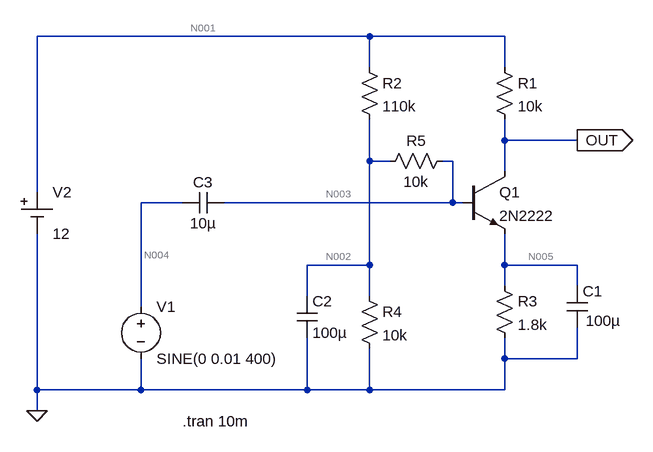
[diagram p0: schematic Common emitter.asc]
Common emitter.asc, the LTspice schematic file:
Version 4
SHEET 1 880 680
WIRE -144 -80 -656 -80
WIRE 64 -80 -144 -80
WIRE -144 -32 -144 -80
WIRE 64 -32 64 -80
WIRE 64 80 64 48
WIRE 176 80 64 80
WIRE -144 112 -144 48
WIRE -112 112 -144 112
WIRE -16 112 -32 112
WIRE 64 128 64 80
WIRE -656 160 -656 -80
WIRE -432 176 -496 176
WIRE -16 176 -16 112
WIRE -16 176 -368 176
WIRE 0 176 -16 176
WIRE -144 272 -144 112
WIRE -144 272 -240 272
WIRE 64 272 64 224
WIRE 176 272 64 272
WIRE 64 304 64 272
WIRE 176 304 176 272
WIRE -240 320 -240 272
WIRE -144 320 -144 272
WIRE -496 336 -496 176
WIRE 64 416 64 384
WIRE 176 416 176 368
WIRE 176 416 64 416
WIRE -656 464 -656 224
WIRE -496 464 -496 416
WIRE -496 464 -656 464
WIRE -240 464 -240 384
WIRE -240 464 -496 464
WIRE -144 464 -144 400
WIRE -144 464 -240 464
WIRE 64 464 64 416
WIRE 64 464 -144 464
WIRE -656 496 -656 464
FLAG -656 496 0
FLAG 176 80 OUT
IOPIN 176 80 Out
SYMBOL npn 0 128 R0
SYMATTR InstName Q1
SYMATTR Value 2N2222
SYMBOL res 48 -48 R0
SYMATTR InstName R1
SYMATTR Value 10k
SYMBOL res -160 -48 R0
SYMATTR InstName R2
SYMATTR Value 110k
SYMBOL res 48 288 R0
SYMATTR InstName R3
SYMATTR Value 1.8k
SYMBOL res -160 304 R0
SYMATTR InstName R4
SYMATTR Value 10k
SYMBOL res -16 96 R90
WINDOW 0 0 56 VBottom 2
WINDOW 3 32 56 VTop 2
SYMATTR InstName R5
SYMATTR Value 10k
SYMBOL cap 160 304 R0
WINDOW 3 29 54 Left 2
SYMATTR InstName C1
SYMATTR Value 100µ
SYMBOL cap -256 320 R0
SYMATTR InstName C2
SYMATTR Value 100µ
SYMBOL cap -368 160 R90
WINDOW 0 0 32 VBottom 2
WINDOW 3 32 32 VTop 2
SYMATTR InstName C3
SYMATTR Value 10µ
SYMBOL voltage -496 320 R0
WINDOW 123 0 0 Left 0
WINDOW 39 0 0 Left 0
SYMATTR InstName V1
SYMATTR Value SINE(0 0.01 400)
SYMBOL Misc\\cell -656 160 R0
WINDOW 123 0 0 Left 0
WINDOW 39 0 0 Left 0
SYMATTR InstName V2
SYMATTR Value 12
TEXT -432 512 Left 2 !.tran 10m

The netlist it stands for:
* Common emitter.asc
Q1 OUT N003 N005 0 2N2222
R1 N001 OUT 10k
R2 N001 N002 110k
R3 N005 0 1.8k
R4 N002 0 10k
R5 N003 N002 10k
C1 N005 0 100µ
C2 N002 0 100µ
C3 N003 N004 10µ
V1 N004 0 SINE(0 0.01 400)
V2 N001 0 12
.model NPN NPN
.model PNP PNP
.lib standard.bjt
.tran 10m
.backanno
.end

* Results of the author's LTspice run, read from the files saved beside the schematic
* Operating Point, zero values left out:
*   V(out) = 9.953 V
*   V(n003) = 982 mV
*   V(n005) = 370.1 mV
*   V(n001) = 12 V
*   V(n002) = 991.4 mV
*   Ic(Q1) = 204.7 µA
*   Ib(Q1) = 939.6 nA
*   Ie(Q1) = -205.6 µA
*   I(R5) = -939.6 nA
*   I(R4) = 99.14 µA
*   I(R3) = 205.6 µA
*   I(R2) = 100.1 µA
*   I(R1) = 204.7 µA
*   I(V2) = -304.7 µA
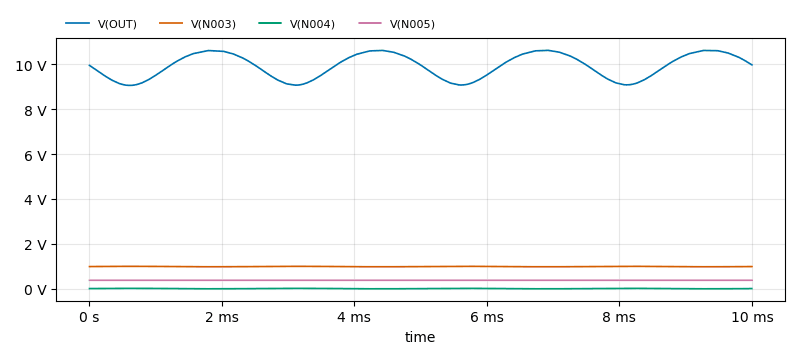
[diagram p1: Transient Analysis of Common emitter.asc, plotted from the saved traces]
* Transient Analysis, 1 run:
*   V(OUT): min 9.062 V, max 10.62 V, average 9.921 V, rms 9.936 V, last 9.976 V
*   V(N003): min 972 mV, max 991.9 mV, average 982 mV, rms 982 mV, last 982 mV
*   V(N004): min -9.914 mV, max 9.998 mV, average 40.47 µV, rms 7.029 mV, last 0 V
*   V(N005): min 370.1 mV, max 370.9 mV, average 370.5 mV, rms 370.5 mV, last 370.3 mV